# Altium schematic sheet Voltage Sensing.SchDoc
size A4
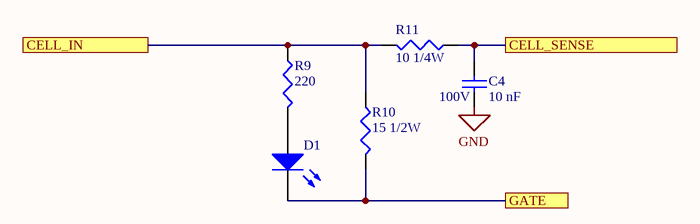
[diagram p0: Voltage Sensing.SchDoc]

## Parts
C4  100V  value 10 nF  [6-0805_N]
D1  LED2  [DIOC1608X06N]  (value not drawn)
R9  value 220  [J1-0603]  (hidden comment: Res3)
R10  value 15 1/2W  [14-1210]  (hidden comment: Res3)
R11  value 10 1/4W  [C1206]

## Ports
CELL_IN, CELL_SENSE, GATE

## Nets
GND: C4.1
CELL_IN: R9.1 R10.1 R11.2 ; port CELL_IN
CELL_SENSE: C4.2 R11.1 ; port CELL_SENSE
GATE: D1.2(K) R10.2 ; port GATE
NetD1_1: D1.1(A) R9.2

## Library data of the parts
C4 = Cap: Capacitor; Published: 8-Jun-2000; LatestRevisionDate: 17-Jul-2002; LatestRevisionNote: Re-released for DXP Platform.; PackageReference: RAD-0.3; Publisher: Altium Limited; PackageDescription: Radial Cap, Thru-Hole; 2 Leads; 0.3 in Pin Spacing
D1 = LED2: Green LED; Published: 8-Jun-2000; LatestRevisionDate: 17-Jul-2002; LatestRevisionNote: Re-released for DXP Platform.; PackageVersion: Feb-2002; PackageReference: 3.2X1.6X1.1; Publisher: Altium Limited; PackageDescription: SM LED; 2 Flat Leads
R9-R11 = Res3: Resistor; Published: 8-Jun-2000; LatestRevisionDate: 29-May-2009; LatestRevisionNote: IPC-7351 Footprint Added.; PackageReference: J1-0603; Publisher: Altium Limited; PackageDescription: Chip Resistor